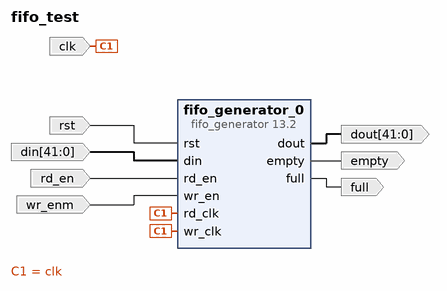
[diagram p0: block diagram of the top level]
# Vivado block design fifo_test, xc7a12tcpg238-2L, Vivado 2018.2
create_bd_design fifo_test

create_bd_port -dir I rst
create_bd_port -dir I clk
create_bd_port -dir I -from 41 -to 0 din
create_bd_port -dir I rd_en
create_bd_port -dir I wr_enm
create_bd_port -dir O full
create_bd_port -dir O empty
create_bd_port -dir O -from 41 -to 0 dout

create_bd_cell -type ip -vlnv xilinx.com:ip:fifo_generator:13.2 fifo_generator_0
set_property -dict [list \
  CONFIG.Fifo_Implementation Independent_Clocks_Builtin_FIFO \
  CONFIG.Input_Data_Width 42 \
] [get_bd_cells fifo_generator_0]

# ---- connections ----

connect_bd_net [get_bd_ports rst] [get_bd_pins fifo_generator_0/rst]
connect_bd_net [get_bd_ports clk] [get_bd_pins fifo_generator_0/wr_clk] [get_bd_pins fifo_generator_0/rd_clk]
connect_bd_net [get_bd_ports din] [get_bd_pins fifo_generator_0/din]
connect_bd_net [get_bd_ports rd_en] [get_bd_pins fifo_generator_0/rd_en]
connect_bd_net [get_bd_ports wr_enm] [get_bd_pins fifo_generator_0/wr_en]
connect_bd_net [get_bd_pins fifo_generator_0/full] [get_bd_ports full]
connect_bd_net [get_bd_pins fifo_generator_0/empty] [get_bd_ports empty]
connect_bd_net [get_bd_pins fifo_generator_0/dout] [get_bd_ports dout]

validate_bd_design
save_bd_design
